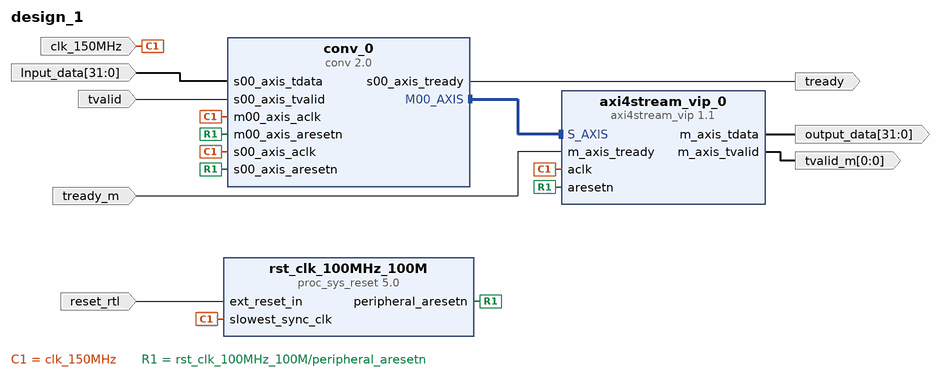
[diagram p0: block diagram of the top level]
# Vivado block design design_1, xc7z020clg400-1, Vivado 2023.2
create_bd_design design_1

create_bd_port -dir I -type clk clk_150MHz
set_property -dict {CONFIG.FREQ_HZ 150000000} [get_bd_ports clk_150MHz]
create_bd_port -dir I -type rst reset_rtl
set_property -dict {CONFIG.POLARITY ACTIVE_LOW} [get_bd_ports reset_rtl]
create_bd_port -dir I -from 31 -to 0 -type data Input_data
create_bd_port -dir I tvalid
create_bd_port -dir O tready
create_bd_port -dir O -from 31 -to 0 -type data output_data
create_bd_port -dir I tready_m
create_bd_port -dir O -from 0 -to 0 tvalid_m

create_bd_cell -type ip -vlnv user.org:user:conv:2.0 conv_0
create_bd_cell -type ip -vlnv xilinx.com:ip:axi4stream_vip:1.1 axi4stream_vip_0
set_property -dict {CONFIG.INTERFACE_MODE PASS_THROUGH} [get_bd_cells axi4stream_vip_0]
create_bd_cell -type ip -vlnv xilinx.com:ip:proc_sys_reset:5.0 rst_clk_100MHz_100M

# ---- connections ----

connect_bd_intf_net [get_bd_intf_pins conv_0/M00_AXIS] [get_bd_intf_pins axi4stream_vip_0/S_AXIS]
connect_bd_net [get_bd_ports Input_data] [get_bd_pins conv_0/s00_axis_tdata]
connect_bd_net [get_bd_ports clk_150MHz] \
  [get_bd_pins axi4stream_vip_0/aclk] [get_bd_pins rst_clk_100MHz_100M/slowest_sync_clk] [get_bd_pins conv_0/s00_axis_aclk] \
  [get_bd_pins conv_0/m00_axis_aclk]
connect_bd_net [get_bd_pins axi4stream_vip_0/m_axis_tdata] [get_bd_ports output_data]
connect_bd_net [get_bd_pins axi4stream_vip_0/m_axis_tvalid] [get_bd_ports tvalid_m]
connect_bd_net [get_bd_pins conv_0/s00_axis_tready] [get_bd_ports tready]
connect_bd_net [get_bd_ports reset_rtl] [get_bd_pins rst_clk_100MHz_100M/ext_reset_in]
connect_bd_net [get_bd_pins rst_clk_100MHz_100M/peripheral_aresetn] \
  [get_bd_pins axi4stream_vip_0/aresetn] [get_bd_pins conv_0/s00_axis_aresetn] [get_bd_pins conv_0/m00_axis_aresetn]
connect_bd_net [get_bd_ports tready_m] [get_bd_pins axi4stream_vip_0/m_axis_tready]
connect_bd_net [get_bd_ports tvalid] [get_bd_pins conv_0/s00_axis_tvalid]

validate_bd_design
save_bd_design
